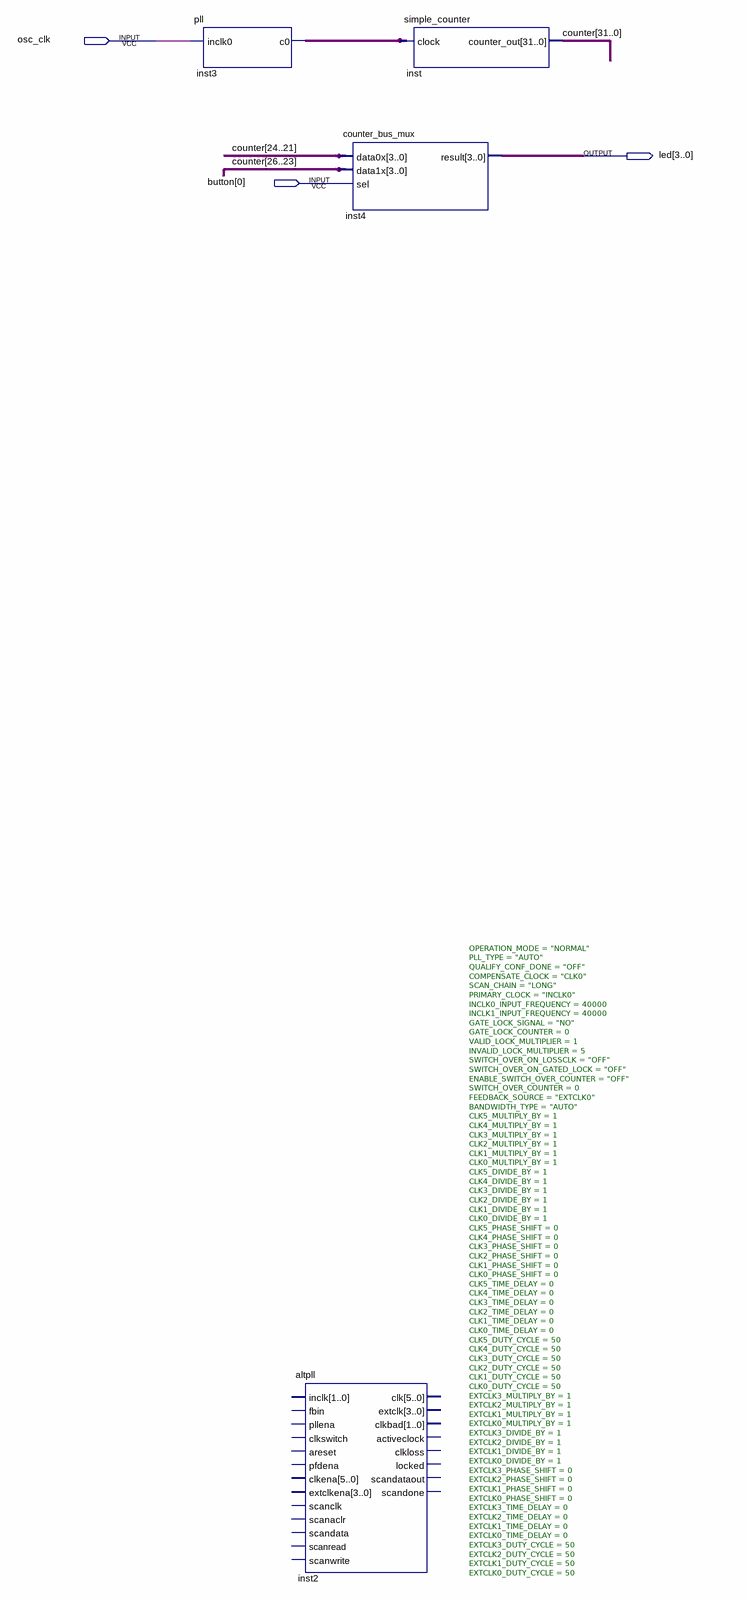
[diagram p0: schematic sheet]
// Quartus schematic my_first_fpga_top.bdf as structural Verilog: 4 symbols, 3 pins
module my_first_fpga_top (
  input  osc_clk,
  input  [0:0] button,
  output [3:0] led
);

  wire inst3_c0;
  wire [31:0] counter;

  pll inst3 (.inclk0(osc_clk), .c0(inst3_c0));
  altpll #(.OPERATION_MODE("NORMAL"), .PLL_TYPE("AUTO"), .QUALIFY_CONF_DONE("OFF"), .COMPENSATE_CLOCK("CLK0"), .SCAN_CHAIN("LONG"), .PRIMARY_CLOCK("INCLK0"), .INCLK0_INPUT_FREQUENCY(40000), .INCLK1_INPUT_FREQUENCY(40000), .GATE_LOCK_SIGNAL("NO"), .GATE_LOCK_COUNTER(0), .VALID_LOCK_MULTIPLIER(1), .INVALID_LOCK_MULTIPLIER(5), .SWITCH_OVER_ON_LOSSCLK("OFF"), .SWITCH_OVER_ON_GATED_LOCK("OFF"), .ENABLE_SWITCH_OVER_COUNTER("OFF"), .SWITCH_OVER_COUNTER(0), .FEEDBACK_SOURCE("EXTCLK0"), .BANDWIDTH_TYPE("AUTO"), .CLK5_MULTIPLY_BY(1), .CLK4_MULTIPLY_BY(1), .CLK3_MULTIPLY_BY(1), .CLK2_MULTIPLY_BY(1), .CLK1_MULTIPLY_BY(1), .CLK0_MULTIPLY_BY(1), .CLK5_DIVIDE_BY(1), .CLK4_DIVIDE_BY(1), .CLK3_DIVIDE_BY(1), .CLK2_DIVIDE_BY(1), .CLK1_DIVIDE_BY(1), .CLK0_DIVIDE_BY(1), .CLK5_PHASE_SHIFT(0), .CLK4_PHASE_SHIFT(0), .CLK3_PHASE_SHIFT(0), .CLK2_PHASE_SHIFT(0), .CLK1_PHASE_SHIFT(0), .CLK0_PHASE_SHIFT(0), .CLK5_TIME_DELAY(0), .CLK4_TIME_DELAY(0), .CLK3_TIME_DELAY(0), .CLK2_TIME_DELAY(0), .CLK1_TIME_DELAY(0), .CLK0_TIME_DELAY(0), .CLK5_DUTY_CYCLE(50), .CLK4_DUTY_CYCLE(50), .CLK3_DUTY_CYCLE(50), .CLK2_DUTY_CYCLE(50), .CLK1_DUTY_CYCLE(50), .CLK0_DUTY_CYCLE(50), .EXTCLK3_MULTIPLY_BY(1), .EXTCLK2_MULTIPLY_BY(1), .EXTCLK1_MULTIPLY_BY(1), .EXTCLK0_MULTIPLY_BY(1), .EXTCLK3_DIVIDE_BY(1), .EXTCLK2_DIVIDE_BY(1), .EXTCLK1_DIVIDE_BY(1), .EXTCLK0_DIVIDE_BY(1), .EXTCLK3_PHASE_SHIFT(0), .EXTCLK2_PHASE_SHIFT(0), .EXTCLK1_PHASE_SHIFT(0), .EXTCLK0_PHASE_SHIFT(0), .EXTCLK3_TIME_DELAY(0), .EXTCLK2_TIME_DELAY(0), .EXTCLK1_TIME_DELAY(0), .EXTCLK0_TIME_DELAY(0), .EXTCLK3_DUTY_CYCLE(50), .EXTCLK2_DUTY_CYCLE(50), .EXTCLK1_DUTY_CYCLE(50), .EXTCLK0_DUTY_CYCLE(50)) inst2 ();  // open: inclk, fbin, pllena, clkswitch, areset, pfdena, clkena, extclkena, scanclk, scanaclr, scandata, scanread, scanwrite, clk, extclk, clkbad, activeclock, clkloss, locked, scandataout, scandone
  counter_bus_mux inst4 (.data0x(counter[24:21]), .data1x(counter[26:23]), .result(led));  // open: sel
  simple_counter inst (.clock(inst3_c0), .counter_out(counter));
endmodule
